# Altium schematic sheet PLD_AVR_Watchdog.SchDoc: Watchdog for RadFET
size A4; SheetTotal: 32
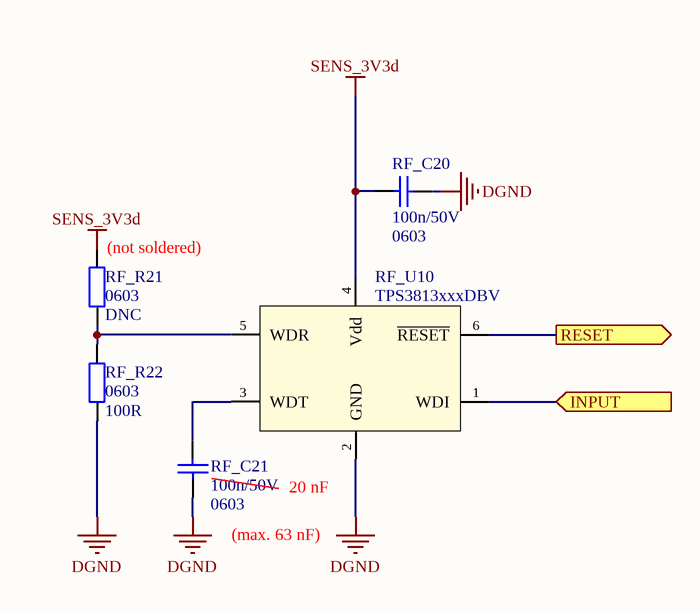
[diagram p0: PLD_AVR_Watchdog.SchDoc]

## Parts
RF_C20  Package: 0603  [SMD_Capacitor_0603]  (hidden comment: 100n/50V)
RF_C21  Package: 0603  [SMD_Capacitor_0603]  (hidden comment: 100n/50V)
RF_R21  0603  value DNC  [SMD_Resistor_0603]
RF_R22  0603  value 100R  [SMD_Resistor_0603]
RF_U10  TPS3813xxxDBV  [SOT23-6]

## Ports
INPUT (in), RESET (out)

## Nets
DGND: RF_C20.2 RF_C21.2 RF_R22.1 RF_U10.2(GND)
SENS_3V3d: RF_C20.1 RF_R21.2 RF_U10.4(Vdd)
INPUT: RF_U10.1(WDI) ; port INPUT
RESET: RF_U10.6(~{RESET}) ; port RESET
NetRF_C21_1: RF_C21.1 RF_U10.3(WDT)
NetRF_R21_1: RF_R21.1 RF_R22.2 RF_U10.5(WDR)

## Notes on the sheet
- (near RF_R21) (not soldered)
- (max. 63 nF)
- (near RF_U10) 20 nF
- Title:
- Project:
- Author:
- Model:
- Document Number:
- Checked by:
- Rev:
- Date:
- Approved by:
- Sheet:
- of
- File name:

## Library data of the parts
RF_C20 RF_C21 = Cer_C0603T104K5RALTU: Ceramic Cap Kemet COTS 100n/50V X7R 0603; Manufacturer: Kemet; ManufacturerPartNumber: C0603T104K5RALTU; Value: 100n/50V
RF_R21 RF_R22 = Res2: Resistor; Published: 8-Jun-2000; LatestRevisionDate: 17-Jul-2002; LatestRevisionNote: Re-released for DXP Platform.; PackageReference: AXIAL-0.4; Publisher: Altium Limited; PackageDescription: Axial Device, Thru-Hole; 2 Leads; 0.4 in Pin Spacing
RF_U10 = TPS3813xxxDBV: Processor Supervisory Circuits with Window-Watchdog.; Manufacturer: Texas Instruments; Value: TPS3813xxxDBV